# EAGLE schematic gdp (EAGLE 4.11)
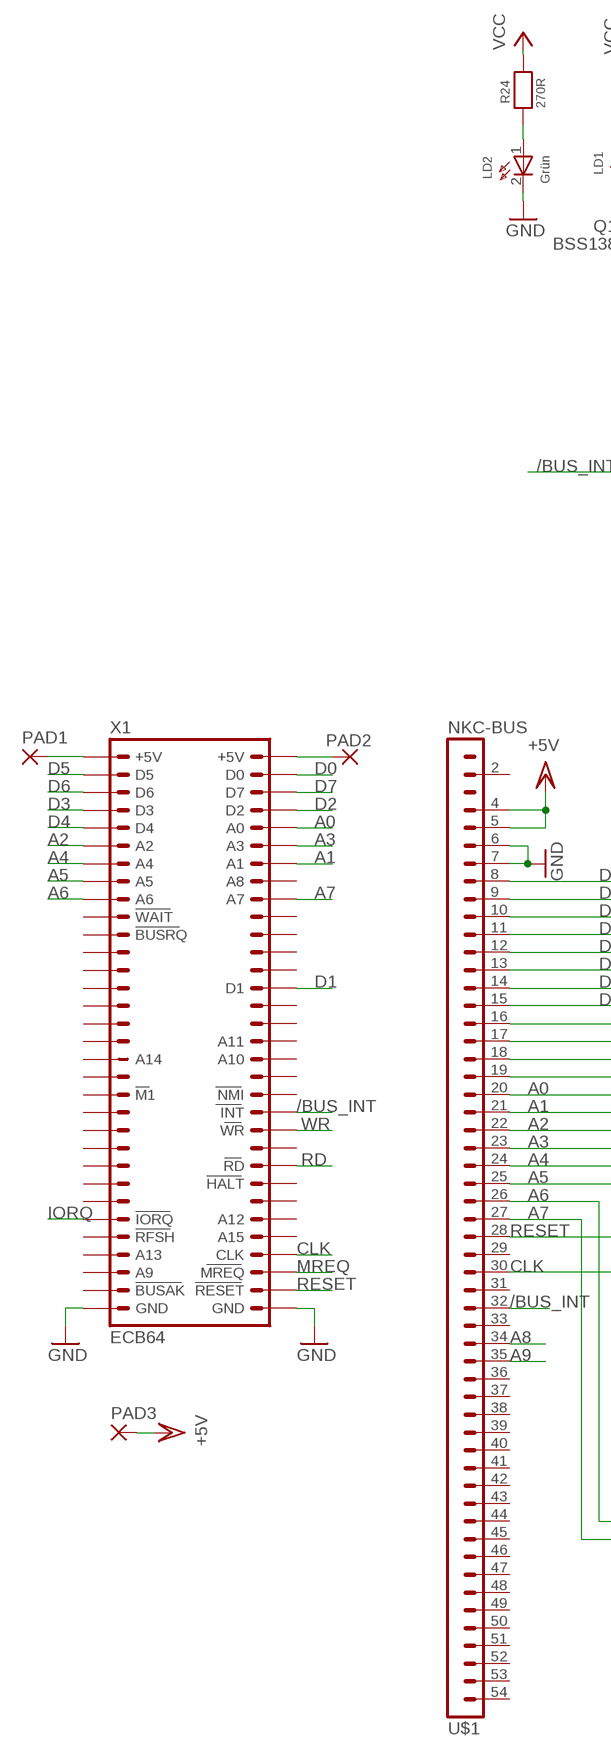
[diagram p0: schematic, sheet 1, part 1 of 2]
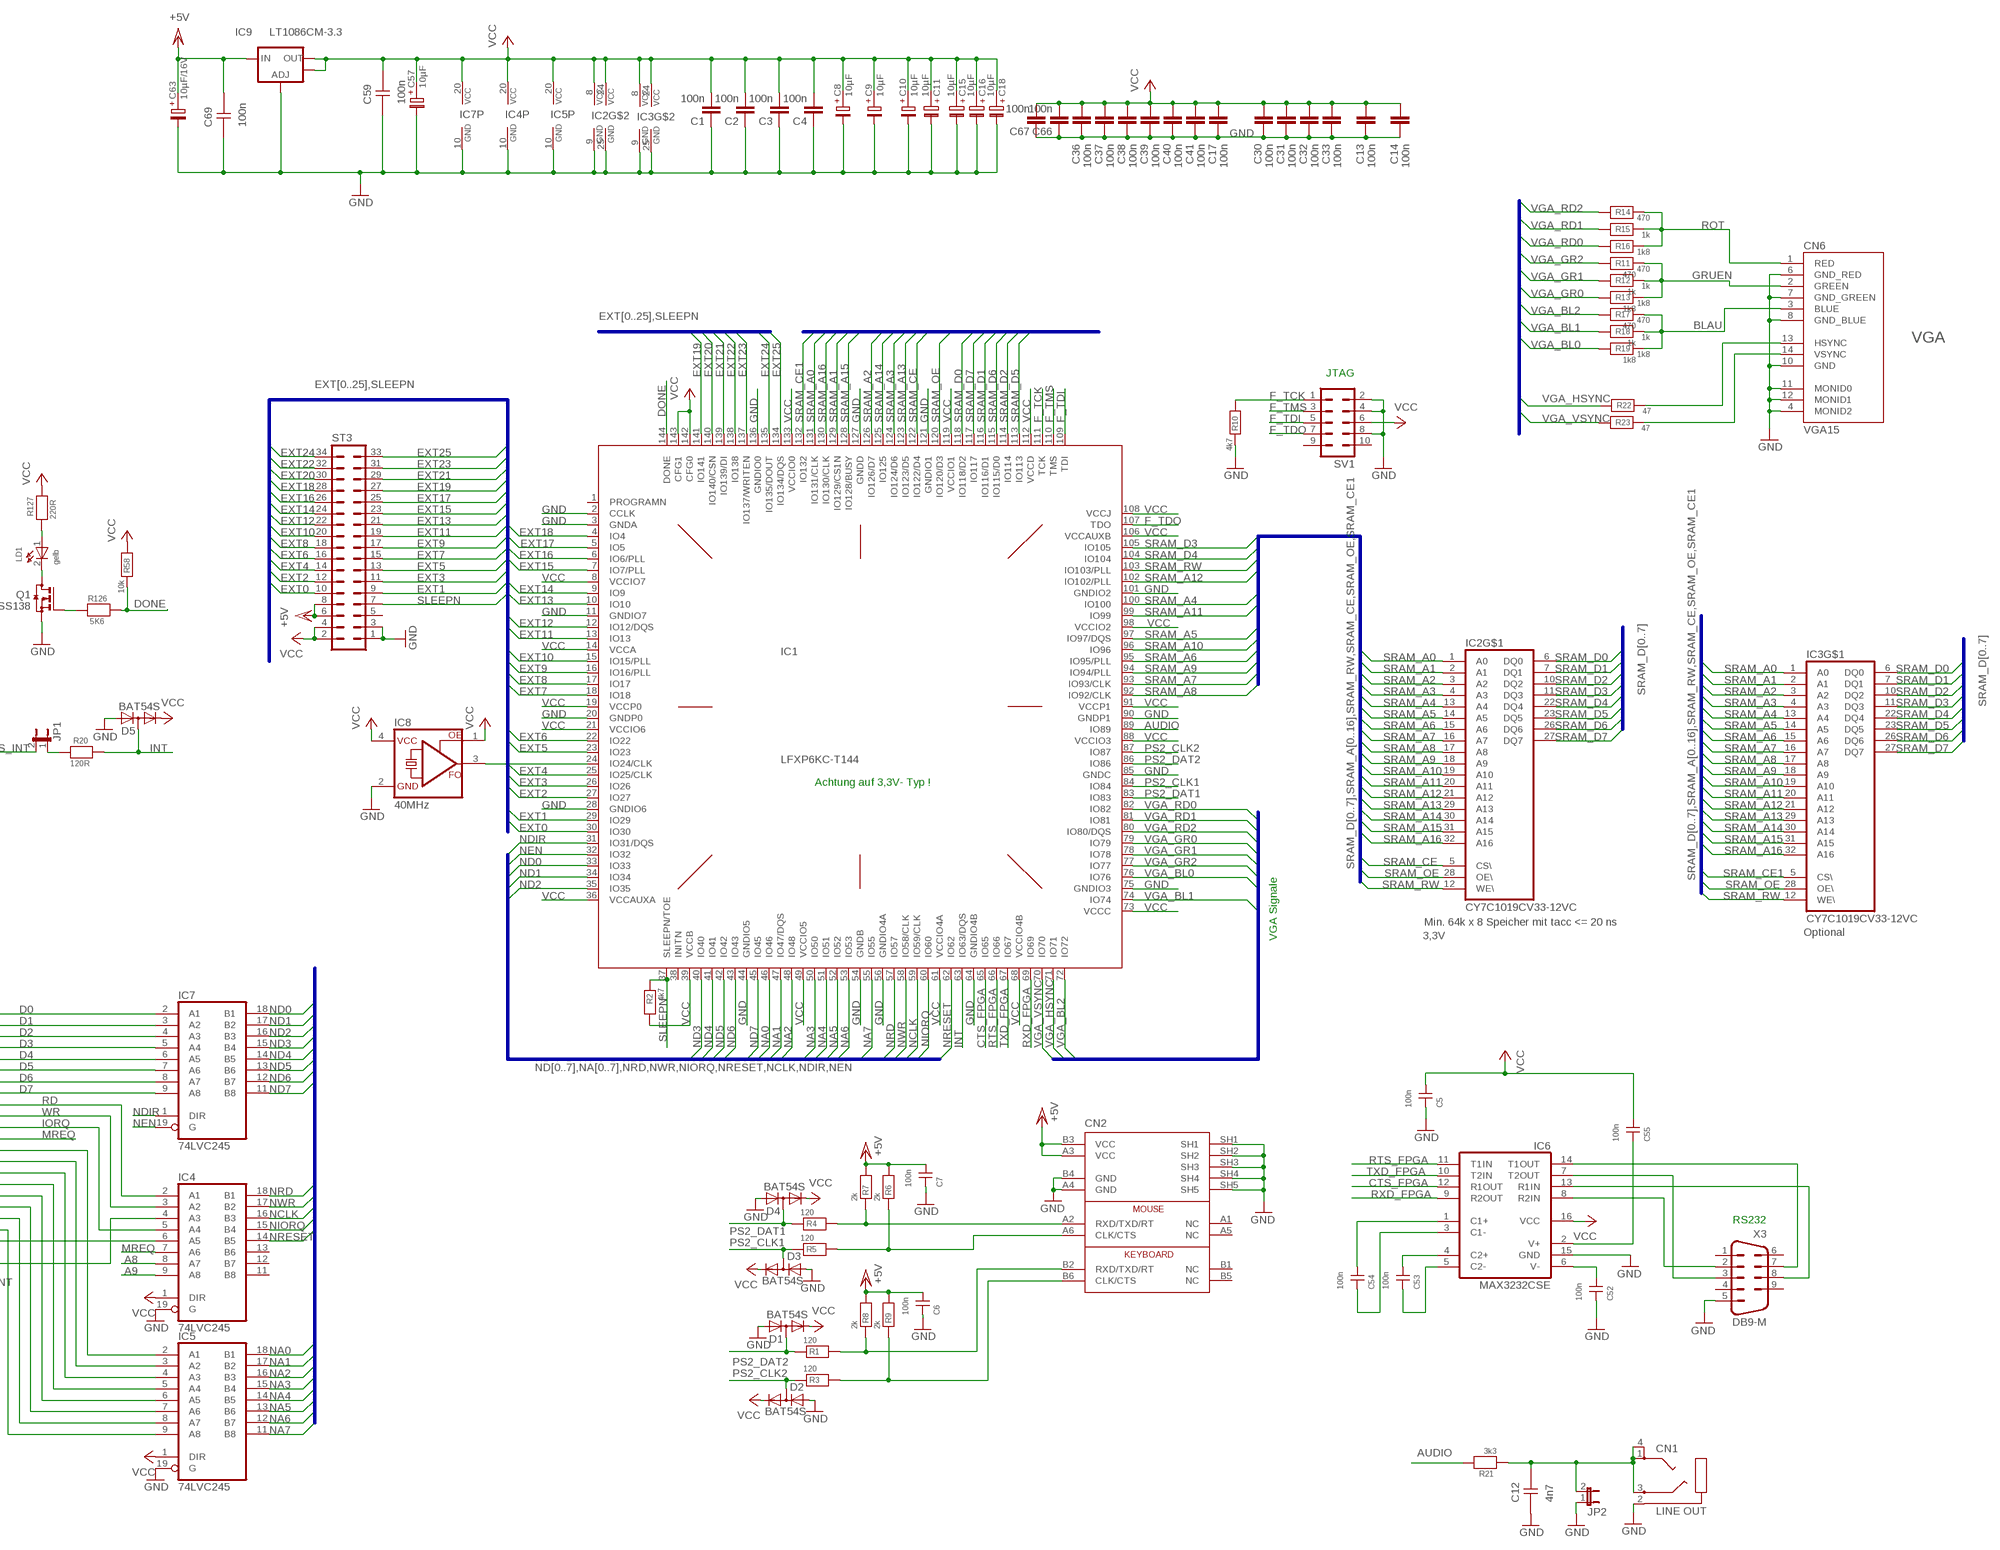
[diagram p1: schematic, sheet 1, part 2 of 2]

## Parts
C1  100n  C-EUC0805K  [C0805K]
C2  100n  C-EUC0805K  [C0805K]
C3  100n  C-EUC0805K  [C0805K]
C4  100n  C-EUC0805K  [C0805K]
C5  100n  CAP0805  [0805]
C6  100n  CAP0805  [0805]
C7  100n  CAP0805  [0805]
C8  10µF  CAPP6032  [TANT_B]
C9  10µF  CAPP6032  [TANT_B]
C10  10µF  CAPP6032  [TANT_B]
C11  10µF  CAPP6032  [TANT_B]
C12  4n7  CAP1206  [0805]
C13  100n  C-EUC0805K  [C0805K]
C14  100n  C-EUC0805K  [C0805K]
C15  10µF  CAPP6032  [TANT_B]
C16  10µF  CAPP6032  [TANT_B]
C17  100n  C-EUC0805K  [C0805K]
C18  10µF  CAPP6032  [TANT_B]
C30  100n  C-EUC0805K  [C0805K]
C31  100n  C-EUC0805K  [C0805K]
C32  100n  C-EUC0805K  [C0805K]
C33  100n  C-EUC0805K  [C0805K]
C36  100n  C-EUC0805K  [C0805K]
C37  100n  C-EUC0805K  [C0805K]
C38  100n  C-EUC0805K  [C0805K]
C39  100n  C-EUC0805K  [C0805K]
C40  100n  C-EUC0805K  [C0805K]
C41  100n  C-EUC0805K  [C0805K]
C52  100n  CAP0805  [0805]
C53  100n  CAP0805  [0805]
C54  100n  CAP0805  [0805]
C55  100n  CAP0805  [0805]
C57  10µF  CAPP6032  [TANT_B]
C59  100n  CAP1206  [0805]
C63  10µF/16V  CAPP6032@2  [TANT_C]
C66  100n  C-EUC0805K  [C0805K]
C67  100n  C-EUC0805K  [C0805K]
C69  100n  CAP1206  [0805]
CN1  LINE OUT  BUCHSE3,5MM  [KLINKE3,5]
CN2  MINIDIN_6POL_DOUBLE  [MINIDIN_6POL_DOUBLE]
CN6  VGA15  VGA15_2  [D-HD15F2]
D1  BAT54S  BAS70-04  [SOT23]
D2  BAT54S  BAS70-04  [SOT23]
D3  BAT54S  BAS70-04  [SOT23]
D4  BAT54S  BAS70-04  [SOT23]
D5  BAT54S  BAS70-04  [SOT23]
IC1  LFXP6KC-T144  [TQFP144]
IC2  CY7C1019CV33-12VC  CY7C1019B  [SOJ32/4]
IC3  CY7C1019CV33-12VC  CY7C1019B  [SOJ32/4]
IC4  74LVC245  74AC245DW  [SO20W]
IC5  74LVC245  74AC245DW  [SO20W]
IC6  MAX3232CSE  MAX3232CWE  [SO16L]
IC7  74LVC245  74AC245DW  [SO20W]
IC8  40MHz  SMDOSZI  [CRYSTAL]
IC9  LT1086CM-3.3  LT1086CM  [3LEAD_DD]
JP1  JP1E  [JP1]
JP2  JP1E  [JP1]
LD1  gelb  LED0603  [0603LED]
LD2  Grün  LED0603  [0603LED]
PAD1  SMD2  [SMD2]
PAD2  SMD2  [SMD2]
PAD3  SMD2  [SMD2]
Q1  BSS138  BSS123  [SOT23]
R1  120  REU0805  [0805]
R2  4k7  REU0805  [0805]
R3  120  REU0805  [0805]
R4  120  REU0805  [0805]
R5  120  REU0805  [0805]
R6  2k  REU0805  [0805]
R7  2k  REU0805  [0805]
R8  2k  REU0805  [0805]
R9  2k  REU0805  [0805]
R10  4k7  REU0805  [0805]
R11  470  REU0805  [0805]
R12  1k  REU0805  [0805]
R13  1k8  REU0805  [0805]
R14  470  REU0805  [0805]
R15  1k  REU0805  [0805]
R16  1k8  REU0805  [0805]
R17  470  REU0805  [0805]
R18  1k  REU0805  [0805]
R19  1k8  REU0805  [0805]
R20  120R  REU0805  [0805]
R21  3k3  REU0805  [0805]
R22  47  REU0805  [0805]
R23  47  REU0805  [0805]
R24  270R  REU0805  [0805]
R58  10k  REU0805  [0805]
R126  5K6  REU0805  [0805]
R127  220R  REU0805  [0805]
ST3  MA17-2  [MA17-2]
SV1  MA05-2  [MA05-2]
U$1  NKC-BUS  [NKC-BUS]
X1  ECB64  [ML64ECB]
X3  DB9-M  M09HP  [M09HP]

## Nets
/BUS_INT: JP1.2 U$1.32 X1.INT
A0: IC5.2(A1) U$1.20 X1.A0
A1: IC5.3(A2) U$1.21 X1.A1
A2: IC5.4(A3) U$1.22 X1.A2
A3: IC5.5(A4) U$1.23 X1.A3
A4: IC5.6(A5) U$1.24 X1.A4
A5: IC5.7(A6) U$1.25 X1.A5
A6: IC5.8(A7) U$1.26 X1.A6
A7: IC5.9(A8) U$1.27 X1.A7
A8: IC4.8(A7) U$1.34
A9: IC4.9(A8) U$1.35
AUDIO: IC1.89(IO89) R21.2
BLAU: CN6.3(BLUE) R17.1 R18.1 R19.1
CLK: IC4.4(A3) U$1.30 X1.CLK
CTS_FPGA: IC1.65(IO65) IC6.12(R1OUT)
D0: IC7.2(A1) U$1.8 X1.D0
D1: IC7.3(A2) U$1.9 X1.D1
D2: IC7.4(A3) U$1.10 X1.D2
D3: IC7.5(A4) U$1.11 X1.D3
D4: IC7.6(A5) U$1.12 X1.D4
D5: IC7.7(A6) U$1.13 X1.D5
D6: IC7.8(A7) U$1.14 X1.D6
D7: IC7.9(A8) U$1.15 X1.D7
DONE: IC1.144(DONE) R58.1 R126.1
EXT0: IC1.30(IO30) ST3.10
EXT1: IC1.29(IO29) ST3.9
EXT2: IC1.27(IO27) ST3.12
EXT3: IC1.26(IO26) ST3.11
EXT4: IC1.25(IO25/CLK) ST3.14
EXT5: IC1.23(IO23) ST3.13
EXT6: IC1.22(IO22) ST3.16
EXT7: IC1.18(IO18) ST3.15
EXT8: IC1.17(IO17) ST3.18
EXT9: IC1.16(IO16/PLL) ST3.17
EXT10: IC1.15(IO15/PLL) ST3.20
EXT11: IC1.13(IO13) ST3.19
EXT12: IC1.12(IO12/DQS) ST3.22
EXT13: IC1.10(IO10) ST3.21
EXT14: IC1.9(IO9) ST3.24
EXT15: IC1.7(IO7/PLL) ST3.23
EXT16: IC1.6(IO6/PLL) ST3.26
EXT17: IC1.5(IO5) ST3.25
EXT18: IC1.4(IO4) ST3.28
EXT19: IC1.141(IO141) ST3.27
EXT20: IC1.140(IO140/CSN) ST3.30
EXT21: IC1.139(IO139/DI) ST3.29
EXT22: IC1.138(IO138) ST3.32
EXT23: IC1.137(IO137/WRITEN) ST3.31
EXT24: IC1.135(IO135/DOUT) ST3.34
EXT25: IC1.134(IO134/DQS) ST3.33
F_TCK: IC1.111(TCK) R10.2 SV1.1
F_TDI: IC1.109(TDI) SV1.5
F_TDO: IC1.107(TDO) SV1.7
F_TMS: IC1.110(TMS) SV1.3
GND: C1.1 C2.1 C3.1 C4.1 C5.1 C6.1 C7.1 C8.2(-) C9.2(-) C10.2(-) C11.2(-) C12.1 C13.1 C14.1 C15.2(-) C16.2(-) C17.1 C18.2(-) C30.1 C31.1 C32.1 C33.1 C36.1 C37.1 C38.1 C39.1 C40.1 C41.1 C52.1 C57.2(-) C59.1 C63.2(-) C66.1 C67.1 C69.1 CN1.2(GND) CN2.A4(GND) CN2.B4(GND) CN2.SH1 CN2.SH2 CN2.SH3 CN2.SH4 CN2.SH5 CN6.4(MONID2) CN6.6(GND_RED) CN6.7(GND_GREEN) CN6.8(GND_BLUE) CN6.10(GND) CN6.11(MONID0) CN6.12(MONID1) D1.1(A) D2.1(A) D3.1(A) D4.1(A) D5.1(A) IC1.2(CCLK) IC1.3(GNDA) IC1.11(GNDIO7) IC1.20(GNDP0) IC1.28(GNDIO6) IC1.44(GNDIO5) IC1.54(GNDB) IC1.56(GNDIO4A) IC1.64(GNDIO4B) IC1.75(GNDIO3) IC1.85(GNDC) IC1.90(GNDP1) IC1.101(GNDIO2) IC1.121(GNDIO1) IC1.127(GNDD) IC1.136(GNDIO0) IC2.9(GND) IC2.25(GND1) IC3.9(GND) IC3.25(GND1) IC4.10(GND) IC4.19(G) IC5.10(GND) IC5.19(G) IC6.15(GND) IC7.10(GND) IC8.2(GND) IC9.1(ADJ) JP2.1 LD2.2(K) Q1.2(S) R10.1 ST3.1 ST3.3 SV1.2 SV1.4 SV1.8 U$1.6 U$1.7 X1.GND X1.GND@1(GND) X3.5
GRUEN: CN6.2(GREEN) R11.1 R12.1 R13.1
INT: D5.3(AC) IC1.63(IO63/DQS) R20.2
IORQ: IC4.5(A4) U$1.18 X1.IORQ
MREQ: IC4.7(A6) U$1.19 X1.MREQ
N$1: IC1.24(IO24/CLK) IC8.3(FO)
N$2: PAD1.1(P) X1.+5V
N$3: LD2.1(A) R24.1
N$4: IC6.14(T1OUT) X3.7
N$5: IC6.13(R1IN) X3.8
N$7: CN2.A2(RXD/TXD/RT) R4.2 R7.1
N$8: C54.2 IC6.1(C1+)
N$9: CN2.A6(CLK/CTS) R5.2 R6.1
N$10: CN2.B2(RXD/TXD/RT) R1.2 R8.1
N$11: CN2.B6(CLK/CTS) R3.2 R9.1
N$18: PAD2.1(P) X1.+5V@1(+5V)
N$20: C54.1 IC6.3(C1-)
N$22: C53.2 IC6.4(C2+)
N$23: C53.1 IC6.5(C2-)
N$27: JP1.1 R20.1
N$28: C12.2 CN1.1(LEFT1) CN1.3(RIGHT) CN1.4(LEFT2) JP2.2 R21.1
N$30: CN6.13(HSYNC) R22.1
N$36: CN6.14(VSYNC) R23.1
N$80: LD1.1(A) R127.1
N$89: LD1.2(K) Q1.3(D)
N$92: Q1.1(G) R126.2
NA0: IC1.46(IO46) IC5.18(B1)
NA1: IC1.47(IO47/DQS) IC5.17(B2)
NA2: IC1.48(IO48) IC5.16(B3)
NA3: IC1.50(IO50) IC5.15(B4)
NA4: IC1.51(IO51) IC5.14(B5)
NA5: IC1.52(IO52) IC5.13(B6)
NA6: IC1.53(IO53) IC5.12(B7)
NA7: IC1.55(IO55) IC5.11(B8)
NCLK: IC1.59(IO59/CLK) IC4.16(B3)
ND0: IC1.33(IO33) IC7.18(B1)
ND1: IC1.34(IO34) IC7.17(B2)
ND2: IC1.35(IO35) IC7.16(B3)
ND3: IC1.40(IO40) IC7.15(B4)
ND4: IC1.41(IO41) IC7.14(B5)
ND5: IC1.42(IO42) IC7.13(B6)
ND6: IC1.43(IO43) IC7.12(B7)
ND7: IC1.45(IO45) IC7.11(B8)
NDIR: IC1.31(IO31/DQS) IC7.1(DIR)
NEN: IC1.32(IO32) IC7.19(G)
NIORQ: IC1.60(IO60) IC4.15(B4)
NRD: IC1.57(IO57) IC4.18(B1)
NRESET: IC1.62(IO62) IC4.14(B5)
NWR: IC1.58(IO58/CLK) IC4.17(B2)
PS2_CLK1: D3.3(AC) IC1.84(IO84) R5.1
PS2_CLK2: D2.3(AC) IC1.87(IO87) R3.1
PS2_DAT1: D4.3(AC) IC1.83(IO83) R4.1
PS2_DAT2: D1.3(AC) IC1.86(IO86) R1.1
RD: IC4.2(A1) U$1.16 X1.RD
RESET: IC4.6(A5) U$1.28 X1.RESET
ROT: CN6.1(RED) R14.1 R15.1 R16.1
RTS_FPGA: IC1.66(IO66) IC6.11(T1IN)
RXD: IC6.8(R2IN) X3.2
RXD_FPGA: IC1.69(IO69) IC6.9(R2OUT)
SLEEPN: IC1.37(SLEEPN/TOE) R2.1 ST3.7
SRAM_A0: IC1.131(IO131/CLK) IC2.1(A0) IC3.1(A0)
SRAM_A1: IC1.129(IO129/CS1N) IC2.2(A1) IC3.2(A1)
SRAM_A2: IC1.126(IO126/D7) IC2.3(A2) IC3.3(A2)
SRAM_A3: IC1.124(IO124/D6) IC2.4(A3) IC3.4(A3)
SRAM_A4: IC1.100(IO100) IC2.13(A4) IC3.13(A4)
SRAM_A5: IC1.97(IO97/DQS) IC2.14(A5) IC3.14(A5)
SRAM_A6: IC1.95(IO95/PLL) IC2.15(A6) IC3.15(A6)
SRAM_A7: IC1.93(IO93/CLK) IC2.16(A7) IC3.16(A7)
SRAM_A8: IC1.92(IO92/CLK) IC2.17(A8) IC3.17(A8)
SRAM_A9: IC1.94(IO94/PLL) IC2.18(A9) IC3.18(A9)
SRAM_A10: IC1.96(IO96) IC2.19(A10) IC3.19(A10)
SRAM_A11: IC1.99(IO99) IC2.20(A11) IC3.20(A11)
SRAM_A12: IC1.102(IO102/PLL) IC2.21(A12) IC3.21(A12)
SRAM_A13: IC1.123(IO123/D5) IC2.29(A13) IC3.29(A13)
SRAM_A14: IC1.125(IO125) IC2.30(A14) IC3.30(A14)
SRAM_A15: IC1.128(IO128/BUSY) IC2.31(A15) IC3.31(A15)
SRAM_A16: IC1.130(IO130/CLK) IC2.32(A16) IC3.32(A16)
SRAM_CE: IC1.122(IO122/D4) IC2.5(CS\)
SRAM_CE1: IC1.132(IO132) IC3.5(CS\)
SRAM_D0: IC1.118(IO118/D2) IC2.6(DQ0) IC3.6(DQ0)
SRAM_D1: IC1.116(IO116/D1) IC2.7(DQ1) IC3.7(DQ1)
SRAM_D2: IC1.114(IO114) IC2.10(DQ2) IC3.10(DQ2)
SRAM_D3: IC1.105(IO105) IC2.11(DQ3) IC3.11(DQ3)
SRAM_D4: IC1.104(IO104) IC2.22(DQ4) IC3.22(DQ4)
SRAM_D5: IC1.113(IO113) IC2.23(DQ5) IC3.23(DQ5)
SRAM_D6: IC1.115(IO115/D0) IC2.26(DQ6) IC3.26(DQ6)
SRAM_D7: IC1.117(IO117) IC2.27(DQ7) IC3.27(DQ7)
SRAM_OE: IC1.120(IO120/D3) IC2.28(OE\) IC3.28(OE\)
SRAM_RW: IC1.103(IO103/PLL) IC2.12(WE\) IC3.12(WE\)
TXD: IC6.7(T2OUT) X3.3
TXD_FPGA: IC1.67(IO67) IC6.10(T2IN)
V+_IC1: C55.1 IC6.2(V+)
V-_IC1: C52.2 IC6.6(V-)
VCC: C1.2 C2.2 C3.2 C4.2 C5.2 C8.1(+) C9.1(+) C10.1(+) C11.1(+) C13.2 C14.2 C15.1(+) C16.1(+) C17.2 C18.1(+) C30.2 C31.2 C32.2 C33.2 C36.2 C37.2 C38.2 C39.2 C40.2 C41.2 C55.2 C57.1(+) C59.2 C66.2 C67.2 D1.2(C) D2.2(C) D3.2(C) D4.2(C) D5.2(C) IC1.8(VCCIO7) IC1.14(VCCA) IC1.19(VCCP0) IC1.21(VCCIO6) IC1.36(VCCAUXA) IC1.39(VCCB) IC1.49(VCCIO5) IC1.61(VCCIO4A) IC1.68(VCCIO4B) IC1.73(VCCC) IC1.88(VCCIO3) IC1.91(VCCP1) IC1.98(VCCIO2) IC1.106(VCCAUXB) IC1.108(VCCJ) IC1.112(VCCD) IC1.119(VCCIO1) IC1.133(VCCIO0) IC1.142(CFG0) IC1.143(CFG1) IC2.8(VCC) IC2.24(VCC3) IC3.8(VCC) IC3.24(VCC3) IC4.1(DIR) IC4.20(VCC) IC5.1(DIR) IC5.20(VCC) IC6.16(VCC) IC7.20(VCC) IC8.1(OE) IC8.4(VCC) IC9.2(OUT) IC9.2@1(OUT1) R2.2 R24.2 R58.2 R127.2 ST3.2 ST3.4 SV1.6
VCC/2: C6.2 C7.2 C63.1(+) C69.2 CN2.A3(VCC) CN2.B3(VCC) IC9.3(IN) PAD3.1(P) R6.2 R7.2 R8.2 R9.2 ST3.6 ST3.8 U$1.4 U$1.5 ; supply symbol labelled +5V
VGA_BL0: IC1.76(IO76) R19.2
VGA_BL1: IC1.74(IO74) R18.2
VGA_BL2: IC1.72(IO72) R17.2
VGA_GR0: IC1.79(IO79) R13.2
VGA_GR1: IC1.78(IO78) R12.2
VGA_GR2: IC1.77(IO77) R11.2
VGA_HSYNC: IC1.71(IO71) R22.2
VGA_RD0: IC1.82(IO82) R16.2
VGA_RD1: IC1.81(IO81) R15.2
VGA_RD2: IC1.80(IO80/DQS) R14.2
VGA_VSYNC: IC1.70(IO70) R23.2
WR: IC4.3(A2) U$1.17 X1.WR
Unconnected: CN2.A1(NC) CN2.A5(NC) CN2.B1(NC) CN2.B5(NC) CN6.5(NC) CN6.9(NC) CN6.15(NC) IC1.1(PROGRAMN) IC1.38(INITN) IC4.11(B8) IC4.12(B7) IC4.13(B6) ST3.5 SV1.9 SV1.10 U$1.2 U$1.29 U$1.31 U$1.33 U$1.36 U$1.37 U$1.38 U$1.39 U$1.40 U$1.41 U$1.42 U$1.43 U$1.44 U$1.45 U$1.46 U$1.47 U$1.48 U$1.49 U$1.50 U$1.51 U$1.52 U$1.53 U$1.54 X1.10C X1.11C X1.12A X1.12C X1.13A X1.13C X1.14A X1.15A X1.15C X1.16A X1.16C X1.17A X1.19A X1.19C X1.21A X1.22A X1.23A X1.23C X1.24A X1.25A X1.26A X1.26C X1.A8 X1.A9 X1.A10 X1.A11 X1.A12 X1.A13 X1.A14 X1.A15 X1.BUSAK X1.BUSRQ X1.HALT X1.M1 X1.NMI X1.RFSH X1.WAIT X3.1 X3.4 X3.6 X3.9

## Buses
SRAM_D[0..7],SRAM_A[0..16],SRAM_RW,SRAM_CE,SRAM_OE,SRAM_CE1
SRAM_D[0..7]
VGA_RD[0..2],VGA_BL[0..2],VGA_GR[0..2],VGA_VSYNC,VGA_HSYNC
ND[0..7],NA[0..7],NRD,NWR,NIORQ,NRESET,NCLK,NDIR,NEN
EXT[0..25],SLEEPN

## Notes on the sheet
- VGA
- JTAG
- Achtung auf 3,3V- Typ !
- VGA Signale
- Min. 64k x 8 Speicher mit tacc <= 20 ns
- Optional
- 3,3V
- RS232

## Power pins joined to a net without a drawn wire
AGND1: CN6.PAD1(AGND1)
AGND2: CN6.PAD2(AGND2)

## Library data of the parts
C1-C4 C13 C14 C17 C30-C33 C36-C41 C66 C67 = rcl:C-EU: CAPACITOR, European symbol
C5-C7 C52-C55 = DISCRSMD:CAP0805
C8-C11 C15 C16 C18 C57 = DiscrSMD@3:CAPP6032
C12 C59 C69 = DiscrSMD@2:CAP1206
C63 = DiscrSMD@3:CAPP6032@2
CN1 = con-audio:BUCHSE3,5MM: 3,5mm Klinkenbuchse
CN2 = Con-pc2:MINIDIN_6POL_DOUBLE
CN6 = CON-PC:VGA15_2
D1-D5 = diode:BAS70-04: Silicon Schottky Diodes General-purpose diode for high-speed switching
IC1 = lattice:LFXP6KC-T144
IC2 IC3 = cy7c1009b:CY7C1019B
IC4 IC5 IC7 = 74xx-eu:74*245: Octal BUS TRANSCEIVER, 3-state
IC6 = Sandbox2:MAX3232CWE
IC8 = mylib:SMDOSZI
IC9 = V-REG2:LT1086CM
JP1 JP2 = jumper:JP1E: JUMPER
LD1 LD2 = DISCRSMD:LED0603
PAD1-PAD3 = wirepad:SMD2: SMD PAD
Q1 = transistor-small-signal:BSS123: N-CHANNEL MOS FET
R1-R24 R58 R126 R127 = DISCRSMD:REU0805
ST3 = con-lstb:MA17-2: PIN HEADER
SV1 = con-lstb:MA05-2: PIN HEADER
U$1 = con-lstb:NKC-BUS
X1 = con-vg:ECB64: CONNECTOR male, 64 pins, block, type C, rows AC, grid 5.08 mm
X3 = con-subd:M09: HARTING SUB-D